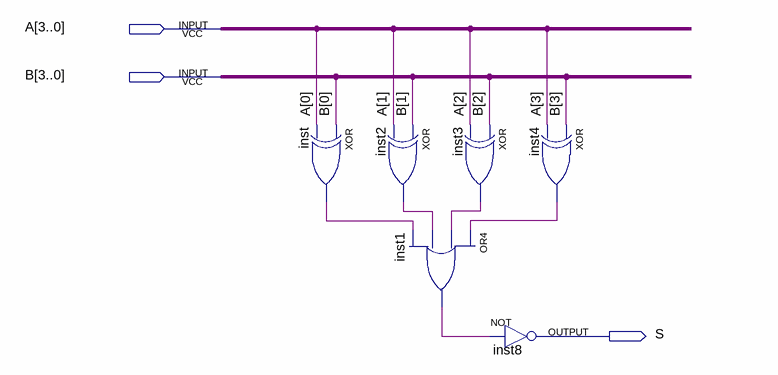
[diagram p0: schematic sheet]
// Quartus schematic Comparador.bdf as structural Verilog: 6 symbols, 3 pins
module Comparador (
  input  [3:0] A,
  input  [3:0] B,
  output S
);

  wire inst1_out, inst2_out, inst3_out, inst4_out, inst_out;

  xor inst (inst_out, B[0], A[0]);
  xor inst2 (inst2_out, B[1], A[1]);
  or inst1 (inst1_out, inst4_out, inst3_out, inst2_out, inst_out);
  xor inst3 (inst3_out, B[2], A[2]);
  xor inst4 (inst4_out, B[3], A[3]);
  not inst8 (S, inst1_out);
endmodule
